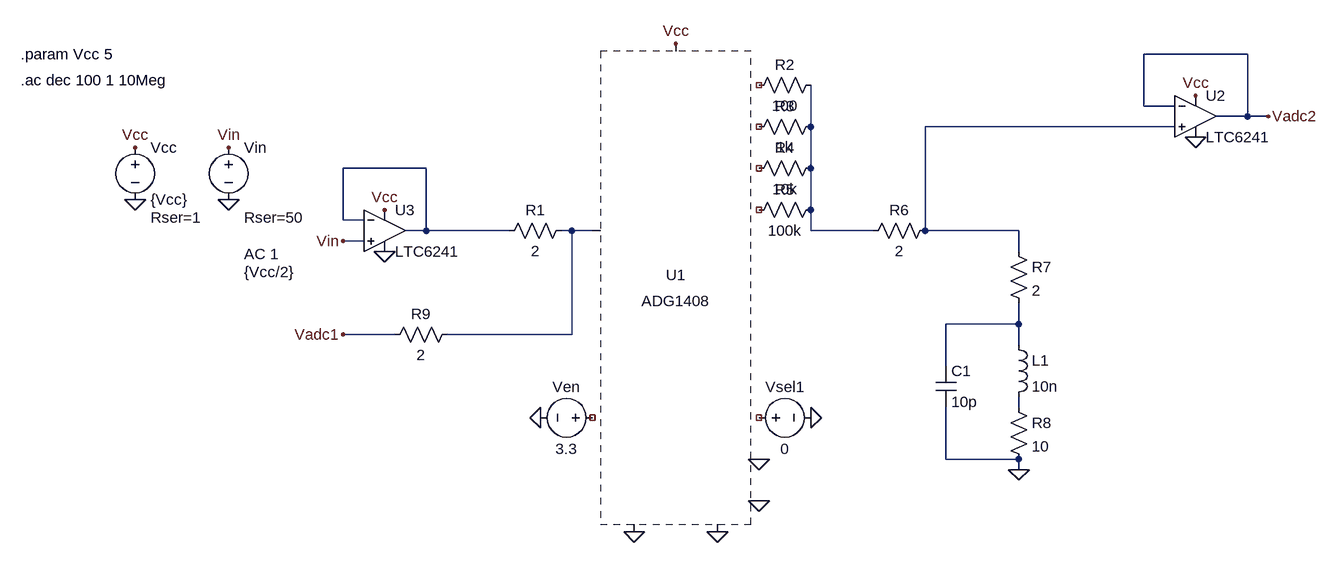
[diagram p0: schematic IV_non_ideal_attempt.asc]
IV_non_ideal_attempt.asc, the LTspice schematic file:
Version 4
SHEET 1 1592 680
WIRE 1472 -144 1312 -144
WIRE 1312 -64 1312 -144
WIRE 1360 -64 1312 -64
WIRE 1472 -48 1472 -144
WIRE 1472 -48 1424 -48
WIRE 1504 -48 1472 -48
WIRE 800 -32 800 -96
WIRE 1360 -32 976 -32
WIRE 208 32 80 32
WIRE 800 32 800 -32
WIRE 800 96 800 32
WIRE 80 112 80 32
WIRE 112 112 80 112
WIRE 208 128 208 32
WIRE 208 128 176 128
WIRE 336 128 208 128
WIRE 432 128 416 128
WIRE 464 128 432 128
WIRE 800 128 800 96
WIRE 896 128 800 128
WIRE 976 128 976 -32
WIRE 1120 128 976 128
WIRE 112 144 80 144
WIRE 1120 160 1120 128
WIRE 1120 272 1120 240
WIRE 1120 272 1008 272
WIRE 160 288 80 288
WIRE 432 288 432 128
WIRE 432 288 240 288
WIRE 1120 304 1120 272
WIRE 1008 336 1008 272
WIRE 1120 400 1120 384
WIRE 1008 480 1008 400
WIRE 1120 480 1008 480
WIRE 1120 496 1120 480
FLAG -240 80 0
FLAG -240 0 Vcc
FLAG -96 80 0
FLAG -96 0 Vin
FLAG 384 416 0
FLAG 528 592 0
FLAG 656 592 0
FLAG 592 -160 Vcc
FLAG 144 160 0
FLAG 80 144 Vin
FLAG 144 96 Vcc
FLAG 720 544 0
FLAG 720 480 0
FLAG 80 288 Vadc1
FLAG 1392 -16 0
FLAG 1392 -80 Vcc
FLAG 1504 -48 Vadc2
FLAG 1120 496 0
FLAG 800 416 0
SYMBOL voltage -240 -16 R0
WINDOW 123 0 0 Left 0
WINDOW 39 24 124 Left 2
SYMATTR InstName Vcc
SYMATTR Value {Vcc}
SYMATTR SpiceLine Rser=1
SYMBOL voltage -96 -16 R0
WINDOW 3 24 208 Left 2
WINDOW 123 24 180 Left 2
WINDOW 39 24 124 Left 2
SYMATTR InstName Vin
SYMATTR Value {Vcc/2}
SYMATTR Value2 AC 1
SYMATTR SpiceLine Rser=50
SYMBOL Switches\\ADG1408 592 160 M0
SYMATTR InstName U1
SYMBOL voltage 480 416 R90
WINDOW 0 -32 56 VBottom 2
WINDOW 3 32 56 VTop 2
SYMATTR InstName Ven
SYMATTR Value 3.3
SYMBOL res 432 112 R90
WINDOW 0 0 56 VBottom 2
WINDOW 3 32 56 VTop 2
SYMATTR InstName R1
SYMATTR Value 2
SYMBOL OpAmps\\LTC6241 144 128 R0
SYMATTR InstName U3
SYMBOL res 816 -112 R90
WINDOW 0 0 56 VBottom 2
WINDOW 3 32 56 VTop 2
SYMATTR InstName R2
SYMATTR Value 100
SYMBOL res 816 -48 R90
WINDOW 0 0 56 VBottom 2
WINDOW 3 32 56 VTop 2
SYMATTR InstName R3
SYMATTR Value 1k
SYMBOL res 816 16 R90
WINDOW 0 0 56 VBottom 2
WINDOW 3 32 56 VTop 2
SYMATTR InstName R4
SYMATTR Value 10k
SYMBOL res 816 80 R90
WINDOW 0 0 56 VBottom 2
WINDOW 3 32 56 VTop 2
SYMATTR InstName R5
SYMATTR Value 100k
SYMBOL res 992 112 R90
WINDOW 0 0 56 VBottom 2
WINDOW 3 32 56 VTop 2
SYMATTR InstName R6
SYMATTR Value 2
SYMBOL res 1104 144 R0
SYMATTR InstName R7
SYMATTR Value 2
SYMBOL OpAmps\\LTC6241 1392 -48 R0
SYMATTR InstName U2
SYMBOL ind 1104 288 R0
SYMATTR InstName L1
SYMATTR Value 10n
SYMBOL cap 992 336 R0
SYMATTR InstName C1
SYMATTR Value 10p
SYMBOL voltage 704 416 R270
WINDOW 0 32 56 VTop 2
WINDOW 3 -32 56 VBottom 2
SYMATTR InstName Vsel1
SYMATTR Value 0
SYMBOL res 256 272 R90
WINDOW 0 0 56 VBottom 2
WINDOW 3 32 56 VTop 2
SYMATTR InstName R9
SYMATTR Value 2
SYMBOL res 1104 384 R0
SYMATTR InstName R8
SYMATTR Value 10
TEXT -416 -144 Left 2 !.param Vcc 5
TEXT -416 -104 Left 2 !.ac dec 100 1 10Meg

The netlist it stands for:
* IV_non_ideal_attempt.asc
Vcc Vcc 0 {Vcc} Rser=1
Vin Vin 0 {Vcc/2} AC 1 Rser=50
* U1: ADG1408 (symbol Switches\ADG1408 not available, pin order unknown); nets seen at it: 0, N004, Vcc
Ven NC_01 0 3.3
R1 N004 N003 2
XU3 Vin N003 Vcc 0 N003 LTC6241  ; pins In+ In- V+ V- OUT
R2 N001 NC_02 100
R3 N001 NC_03 1k
R4 N001 NC_04 10k
R5 N001 NC_05 100k
R6 N002 N001 2
R7 N002 N005 2
XU2 N002 Vadc2 Vcc 0 Vadc2 LTC6241  ; pins In+ In- V+ V- OUT
L1 N005 N006 10n
C1 N005 0 10p
Vsel1 NC_06 0 0
R9 N004 Vadc1 2
R8 N006 0 10
.param Vcc 5
.ac dec 100 1 10Meg
.lib LTC4.lib
.backanno
.end